# EAGLE design Pimitachi (EAGLE 9.2.0)
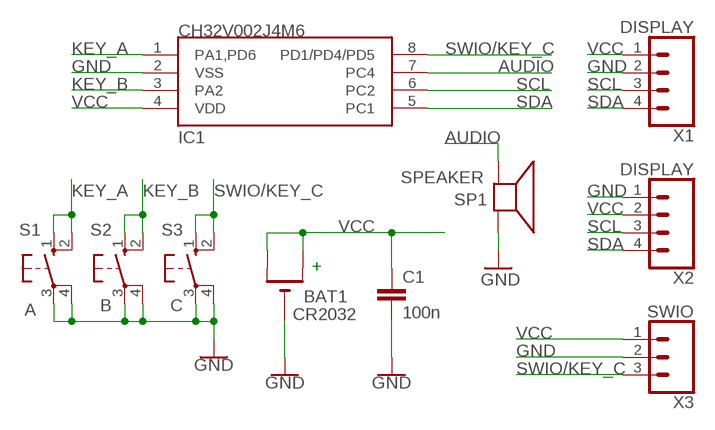
[diagram p0: schematic, sheet 1]

## Parts
BAT1  CR2032  CR2032THM  [CR2032-THRU]
C1  100n  C-EUC1206K  [C1206K]
IC1  CH32V002J4M6  CH32V003J4M6  [SOP8]
S1  A  10-XX  [B3F-10XX]
S2  B  10-XX  [B3F-10XX]
S3  C  10-XX  [B3F-10XX]
SP1  SPEAKER  SPEAKERSPEAKER-PIEZO  [SPEAKER-PIEZO]
X1  DISPLAY  CONN_04  [1X04]
X2  DISPLAY  CONN_04  [1X04]
X3  SWIO  CONN_031X03_SMD_RA_MALE_POST_SMALLEST  [1X03_SMD_RA_MALE_POST_SMALLEST]

## Nets
AUDIO: IC1.7(PC4) SP1.1(+)
GND: BAT1.- C1.2 IC1.2(VSS) S1.3(P) S1.4(P1) S2.3(P) S2.4(P1) S3.3(P) S3.4(P1) SP1.2(-) X1.2 X2.1 X3.2
KEY_A: IC1.1(PA1,PD6) S1.1(S) S1.2(S1)
KEY_B: IC1.3(PA2) S2.1(S) S2.2(S1)
SCL: IC1.6(PC2) X1.3 X2.3
SDA: IC1.5(PC1) X1.4 X2.4
SWIO/KEY_C: IC1.8(PD1/PD4/PD5) S3.1(S) S3.2(S1) X3.3
VCC: BAT1.+1(+) BAT1.+2(+1) C1.1 IC1.4(VDD) X1.1 X2.2 X3.1

## Notes on the sheet
- +

## Library data of the parts
BAT1 = adafruit_ET58_LCD:CR2032
C1 = rcl:C-EU: CAPACITOR, European symbol; SPICEPREFIX: C
IC1 = CH32V:CH32V003J4M6
S1-S3 = switch-omron:10-XX: OMRON SWITCH; MPN: B3F-1000; OC_FARNELL: 176432; OC_NEWARK: 36M3542
SP1 = adafruit:SPEAKER: SPEAKER Source: Buerklin Added PS12 (for part # PS1240 piezo) http://www.ladyada.net/library/pcb/eaglelibrary.html
X1 X2 = SparkFun-Connectors:CONN_04: Multi connection point. Often used as Generic Header-pin footprint for 0.1 inch spaced/style header connections On any of the 0.1 inch spaced packages, you can populate with these: Break Away Headers - Straight <https://www.sparkfun.com/products/116> (PRT-00116) Break Away Male Headers - Right Angle <https://www.sparkfun.com/products/553> (PRT-00553) Female Headers <https://www.sparkfun.com/products/115> (PRT-00115) Break Away Headers - Machine Pin <https://www.sparkfun.com/products/117> (PRT-00117) Break Away Female Headers - Swiss Machine Pin <https://www.sparkfun.com/products/743> (PRT-00743) For SCREWTERMINALS and SPRING TERMINALS visit here: Screw Terimnals on SparkFun.com <https://www.sparkfun.com/search/results?term=Screw+Terminals> (5mm/3.5mm/2.54mm spacing) This device is also useful as a general connection point to wire up your design to another part of your project. Our various solder wires solder well into these plated through hole pads. Hook-Up Wire - Assortment (Stranded, 22 AWG) <https://www.sparkfun.com/products/11375> (PRT-11375) Hook-Up Wire - Assortment (Solid Core, 22 AWG) <https://www.sparkfun.com/products/11367> (PRT-11367) View the entire wire category on our website here <https://www.sparkfun.com/categories/141> Special notes: Molex polarized connector foot print use with SKU : PRT-08231 with associated crimp pins and housings. 1MM SMD Version SKU: PRT-10208; PROD_ID: CONN-09696
X3 = SparkFun-Connectors:CONN_03: Multi connection point. Often used as Generic Header-pin footprint for 0.1 inch spaced/style header connections On any of the 0.1 inch spaced packages, you can populate with these: Break Away Headers - Straight <https://www.sparkfun.com/products/116> (PRT-00116) Break Away Male Headers - Right Angle <https://www.sparkfun.com/products/553> (PRT-00553) Female Headers <https://www.sparkfun.com/products/115> (PRT-00115) Break Away Headers - Machine Pin <https://www.sparkfun.com/products/117> (PRT-00117) Break Away Female Headers - Swiss Machine Pin <https://www.sparkfun.com/products/743> (PRT-00743) Stackable Header - 3 Pin (Female, 0.1") <https://www.sparkfun.com/products/13875> (PRT-13875) For SCREWTERMINALS and SPRING TERMINALS visit here: Screw Terimnals on SparkFun.com <https://www.sparkfun.com/search/results?term=Screw+Terminals> (5mm/3.5mm/2.54mm spacing) This device is also useful as a general connection point to wire up your design to another part of your project. Our various solder wires solder well into these plated through hole pads. Hook-Up Wire - Assortment (Stranded, 22 AWG) <https://www.sparkfun.com/products/11375> (PRT-11375) Hook-Up Wire - Assortment (Solid Core, 22 AWG) <https://www.sparkfun.com/products/11367> (PRT-11367) View the entire wire category on our website here <https://www.sparkfun.com/categories/141> Special notes: Molex polarized connector foot print use with SKU : PRT-08232 with associated crimp pins and housings.

## Board
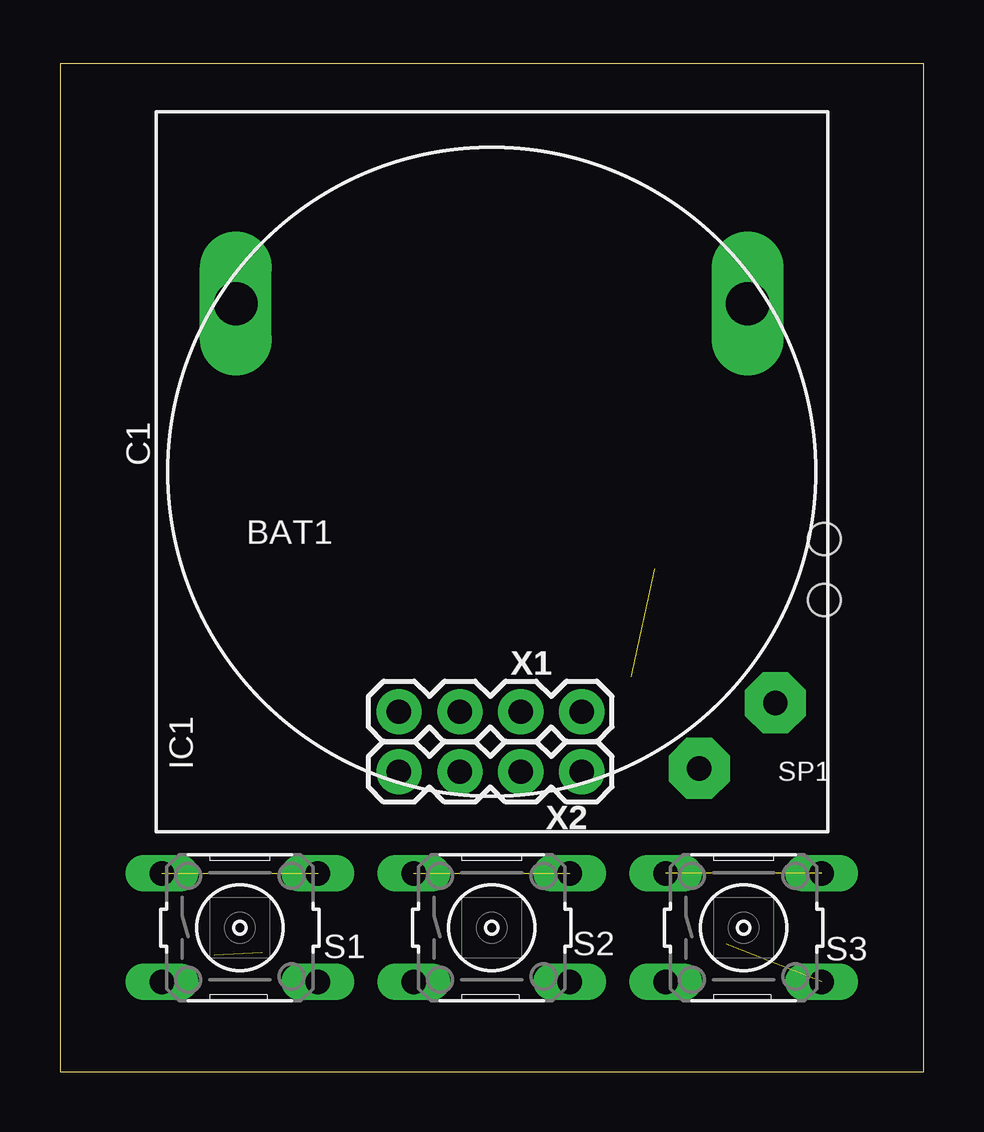
[diagram p1: board, top side]
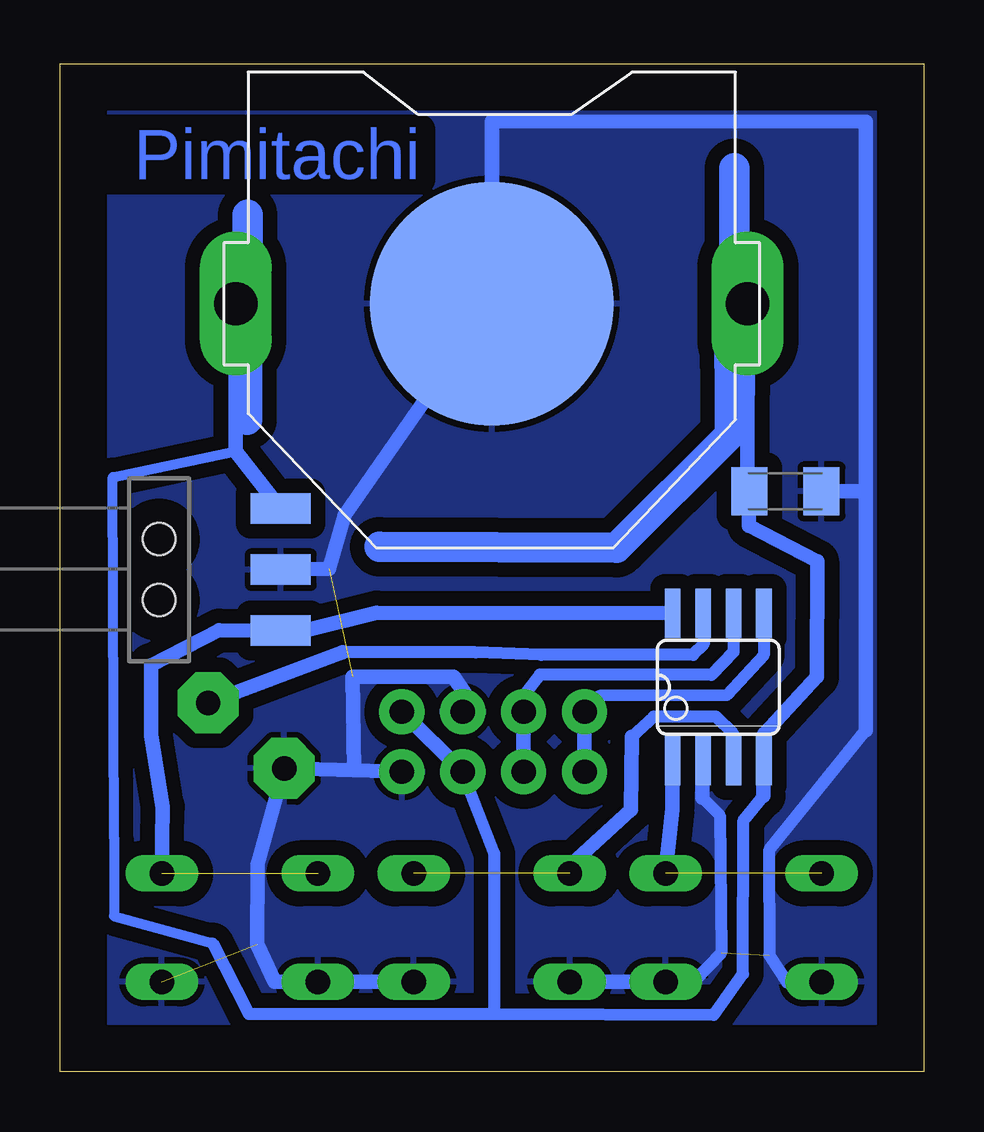
[diagram p2: board, bottom side, seen from below]

Size 36 x 42 mm. Coordinates in mm from the lower left corner, seen from the top.
Outline: 0,0 36,0 36,42 0,42 0,0
Copper layers (1*16): Top 0.035mm / dielectric 1.5mm / Bottom 0.035mm
Design rules "default": minimum track width 6mil, minimum drill 0.35mm, track to track 6mil, track to pad 6mil, pad to pad 6mil, via to via 6mil, smd to smd 6mil, copper to edge 40mil, drill to drill 6mil, minimum pad ring 10mil, minimum via ring 8mil, stop-mask expansion 4mil, vias tented up to drill 0mil, thermal gap 10mil

### Footprints (pad centres in the part's own frame; a part is rotated, then mirrored left to right if it is on the bottom)
CR2032-THRU = drill 1.8 pad 3 long: +1 -10.668,0; +2 10.668,0 | smd 10.16 x 10.16: - 0,0
C1206K = smd 1.5 x 2: 1 -1.5,0; 2 1.5,0
SOP8 = smd 0.66 x 2.032: 1 -1.905,-3.073; 2 -0.635,-3.073; 3 0.635,-3.073; 4 1.905,-3.073; 5 1.905,3.073; 6 0.635,3.073; 7 -0.635,3.073; 8 -1.905,3.073
B3F-10XX = drill 1.016 long: 1 -3.251,2.261; 2 3.251,2.261; 3 -3.251,-2.261; 4 3.251,-2.261
SPEAKER-PIEZO = drill 1.016 pad 2.54 octagon: 1 11.825,-9.635; 2 8.65,-12.365
1X04 = drill 1.016 pad 1.88: 1 0,0; 2 2.54,0; 3 5.08,0; 4 7.62,0
1X03_SMD_RA_MALE_POST_SMALLEST = smd 1.27 x 2.5: 1 -2.54,5.07; 2 0,5.07; 3 2.54,5.07 | hole 1.346: -1.27,0; 1.27,0

### Placement (x,y rotation side)
BAT1  18,32 0 bottom
C1  5.76,24.18 0 bottom
IC1  8.55,16.03 0 bottom
S1  7.5,6 0 top
S2  18,6 0 top
S3  28.5,6 0 top
SP1  18,25 0 top
X1  21.75,15 180 top
X2  21.75,12.5 180 top
X3  31.86,20.92 270 bottom

### Tracks (layer width: path | path; a pad name or v marks a point on that pad's centre or on a via)
AUDIO
  Bottom 0.508: IC1.7 9.16,17.81 9.61,17.37 15.94,17.37 18.67,17.47 24.21,17.48
  Bottom 0.61: 24.21,17.48 SP1.1
GND  (3 unrouted)
  Bottom 0.508: 9.22,11.41 8.49,10.68 8.43,4.96 9.56,3.8 | 2.4,14.22 6.44,9.22 6.44,4.86 5.69,3.72 S1.3
  Bottom 0.61: S2.3 S1.4 9.56,3.8 | S2.4 S3.3 27.05,3.74 27.77,5.31 27.76,8.64 SP1.2 23.74,12.56 | 23.74,12.56 X2.1 | X1.2 19.12,15.74 19.59,16.46 23.8,16.46 23.74,12.56 | 2.41,24.2 2.41,39.58 17.99,39.61 BAT1.- 24.14,23.19 24.78,20.95 X3.2 | 2.41,24.2 2.4,14.22 | 9.22,11.41 IC1.2 | 2.41,24.2 C1.2
  pour Bottom (isolate 0.61): 2,2 2,40 34,40 34,2
KEY_A  (1 unrouted)
  Bottom 0.61: IC1.1 10.47,10.94 S1.2
KEY_B  (1 unrouted)
  Bottom 0.508: IC1.3 7.93,14.07 8.66,14.8 11.24,14.8 12.17,13.97
  Bottom 0.61: 12.17,13.97 12.19,10.91 14.67,8.64 S2.1
SCL
  Bottom 0.508: IC1.6 7.92,17.5 8.84,16.53 15.99,16.54 16.63,15.71 X1.3
  Bottom 0.61: X2.3 X1.3
SDA
  Bottom 0.508: IC1.5 6.67,17.36 8.21,15.69 13.46,15.67 14.05,15.37 X1.4
  Bottom 0.61: X2.4 X1.4
SWIO/KEY_C  (1 unrouted)
  Bottom 0.61: IC1.8 22.8,19.13 25.66,18.41 X3.3 29.36,18.39 32.2,16.94 32.21,14.02 31.71,11.03 S3.2
VCC
  Bottom 0.406: 29.64,5.35 33.74,6.48 33.74,9.76 33.8,24.77 28.67,25.85
  Bottom 0.508: 29.64,5.35 28.13,2.41 17.88,2.41 | 17.88,2.41 17.89,9.09 X2.2 | 17.88,2.41 8.75,2.37 7.53,4.08 7.5,10.48 6.67,11.49
  Bottom 0.61: X2.2 X1.1 | BAT1.+2 7.34,24.36 C1.1 7.27,22.75 4.44,21.27 4.44,16.45 6.64,14.08 IC1.4 6.67,11.49 | X3.1 28.67,25.85 BAT1.+1
  Bottom 1.27: 7.88,37.63 7.89,31.92 BAT1.+2 8.1,32.04 8.07,26.54 12.8,21.84 22.68,21.88 | 28.18,35.71 28.15,32 BAT1.+1 28.2,31.86 28.2,27.17

### Text on the board
Bottom: Pimitachi
Document: VCC | GND | SWIO | -GND-VCC | -VCC-GND